# EAGLE design MagEnc (EAGLE 9.4.0)
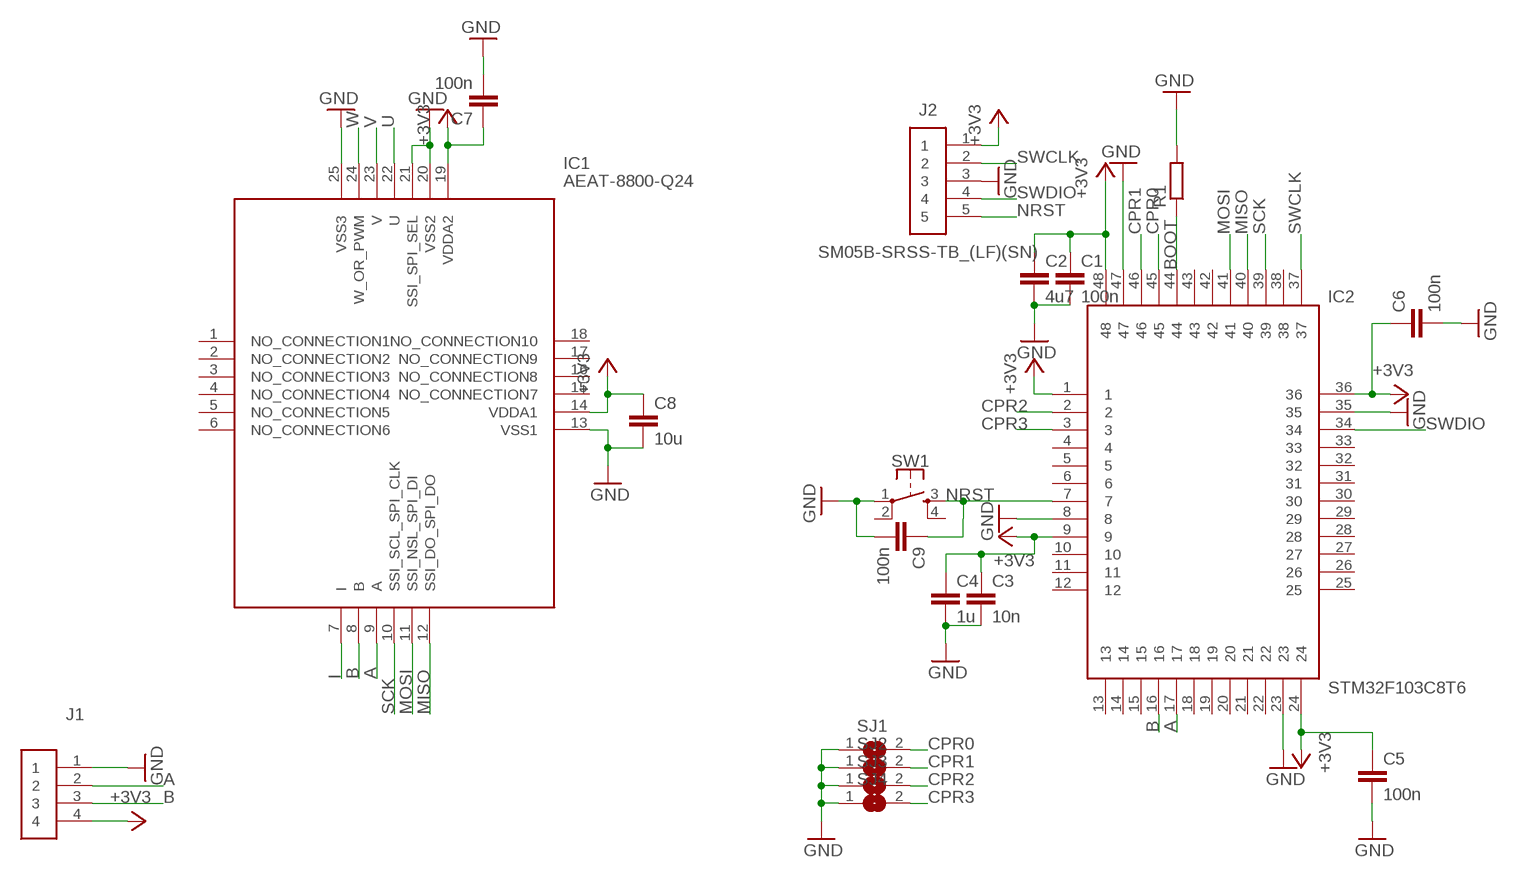
[diagram p0: schematic, sheet 1]

## Parts
C1  100n  C-EUC0402K  [C0402K]
C2  4u7  C-EUC0603K  [C0603K]
C3  10n  C-EUC0402K  [C0402K]
C4  1u  C-EUC0603K  [C0603K]
C5  100n  C-EUC0402K  [C0402K]
C6  100n  C-EUC0402K  [C0402K]
C7  100n  C-EUC0402K  [C0402K]
C8  10u  C-EUC0603K  [C0603K]
C9  100n  C-EUC0402K  [C0402K]
IC1  AEAT-8800-Q24  [QFN65P500X500X90-25N]
IC2  STM32F103C8T6  STM32_LQFP48_7X7  [QFP50P900X900X160-48N]
J1  DF65-4P-1.7V(21)  [DF654P17V21]
J2  SM05B-SRSS-TB_(LF)(SN)  [SM05B-SRSS-TB]
R1  R-EU_R0402  [R0402]
SJ1  SJ  [SJ]
SJ2  SJ  [SJ]
SJ3  SJ  [SJ]
SJ4  SJ  [SJ]
SW1  SKRPACE010  [SMT(4.2X3.2)]

## Nets
+3V3: C1.1 C2.1 C3.1 C4.1 C5.1 C6.1 C7.1 C8.1 IC1.14(VDDA1) IC1.19(VDDA2) IC2.1 IC2.9 IC2.24 IC2.36 IC2.48 J1.4 J2.1
A: IC1.9(A) IC2.17 J1.2
B: IC1.8(B) IC2.16 J1.3
BOOT: IC2.44 R1.1
CPR0: IC2.45 SJ1.2
CPR1: IC2.46 SJ2.2
CPR2: IC2.2 SJ3.2
CPR3: IC2.3 SJ4.2
GND: C1.2 C2.2 C3.2 C4.2 C5.2 C6.2 C7.2 C8.2 C9.2 IC1.13(VSS1) IC1.20(VSS2) IC1.21(SSI_SPI_SEL) IC1.25(VSS3) IC2.8 IC2.23 IC2.35 IC2.47 J1.1 J2.3 R1.2 SJ1.1 SJ2.1 SJ3.1 SJ4.1 SW1.1
I: IC1.7(I)
MISO: IC1.12(SSI_DO_SPI_DO) IC2.40
MOSI: IC1.11(SSI_NSL_SPI_DI) IC2.41
NRST: C9.1 IC2.7 J2.5 SW1.3
SCK: IC1.10(SSI_SCL_SPI_CLK) IC2.39
SWCLK: IC2.37 J2.2
SWDIO: IC2.34 J2.4
U: IC1.22(U)
V: IC1.23(V)
W: IC1.24(W_OR_PWM)
Unconnected: IC1.1(NO_CONNECTION1) IC1.2(NO_CONNECTION2) IC1.3(NO_CONNECTION3) IC1.4(NO_CONNECTION4) IC1.5(NO_CONNECTION5) IC1.6(NO_CONNECTION6) IC1.15(NO_CONNECTION7) IC1.16(NO_CONNECTION8) IC1.17(NO_CONNECTION9) IC1.18(NO_CONNECTION10) IC2.4 IC2.5 IC2.6 IC2.10 IC2.11 IC2.12 IC2.13 IC2.14 IC2.15 IC2.18 IC2.19 IC2.20 IC2.21 IC2.22 IC2.25 IC2.26 IC2.27 IC2.28 IC2.29 IC2.30 IC2.31 IC2.32 IC2.33 IC2.38 IC2.42 IC2.43 SW1.2 SW1.4

## Library data of the parts
C1-C9 = rcl:C-EU: CAPACITOR, European symbol; SPICEPREFIX: C
IC1 = AEAT-8800-Q24:AEAT-8800-Q24: 16-BIT PROG ANG ENCODER Source: Datasheet <https://jp.broadcom.com/products/motion-control-encoders/magnetic-encoders/aeat-8800-q24>; ARROW_PART_NUMBER: AEAT-8800-Q24; DESCRIPTION: 16-BIT PROG ANG ENCODER; HEIGHT: 0.9mm; MANUFACTURER_NAME: Avago Technologies; MANUFACTURER_PART_NUMBER: AEAT-8800-Q24
IC2 = STM32:STM32_LQFP48_7X7
J1 = DF65-4P-1.7V(21):DF65-4P-1.7V(21): Hirose DF Series, Series Number 65, 1.7mm Pitch 4 Way 1 Row Straight PCB Header, Solder Termination, 4A Source: Datasheet <https://www.hirose.com/product/en/download_file/key_name/DF65-4P-1.7V(21)/category/Drawing (2D)/doc_file_id/45650/?file_category_id=6&item_id=06666006021&is_series=>; DESCRIPTION: Hirose DF Series, Series Number 65, 1.7mm Pitch 4 Way 1 Row Straight PCB Header, Solder Termination, 4A; HEIGHT: 1mm; MANUFACTURER_NAME: Hirose; MANUFACTURER_PART_NUMBER: DF65-4P-1.7V(21); RS_PART_NUMBER: 8735161P; SUPPLIER_NAME: RS
J2 = SMxxB-SRSS-TB_(LF)(SN):SM05B-SRSS-TB_(LF)(SN): JST SH Series, 1mm Pitch 5 Way 1 Row Right Angle PCB Header, Solder Termination, 1A <https://componentsearchengine.com/Images/9/SM05B-SRSS-TB%28LF%29%28SN%29.jpg> Source: Datasheet <http://www.jst-mfg.com/product/pdf/eng/eSH.pdf>; DESCRIPTION: JST SH Series, 1mm Pitch 5 Way 1 Row Right Angle PCB Header, Solder Termination, 1A; HEIGHT: mm; MANUFACTURER_NAME: JST (JAPAN SOLDERLESS TERMINALS); MANUFACTURER_PART_NUMBER: SM05B-SRSS-TB(LF)(SN); SUPPLIER_NAME: RS
R1 = rcl:R-EU_: RESISTOR, European symbol; SPICEPREFIX: R
SJ1-SJ4 = jumper:SJ: SMD solder JUMPER
SW1 = SKRPACE010:SKRPACE010: Tactile Switches 4.2x3.2x2.5mm 260gf Source: Datasheet <http://www.alps.com/prod/info/E/HTML/Tact/SurfaceMount/SKRP/SKRPACE010.html>

## Board
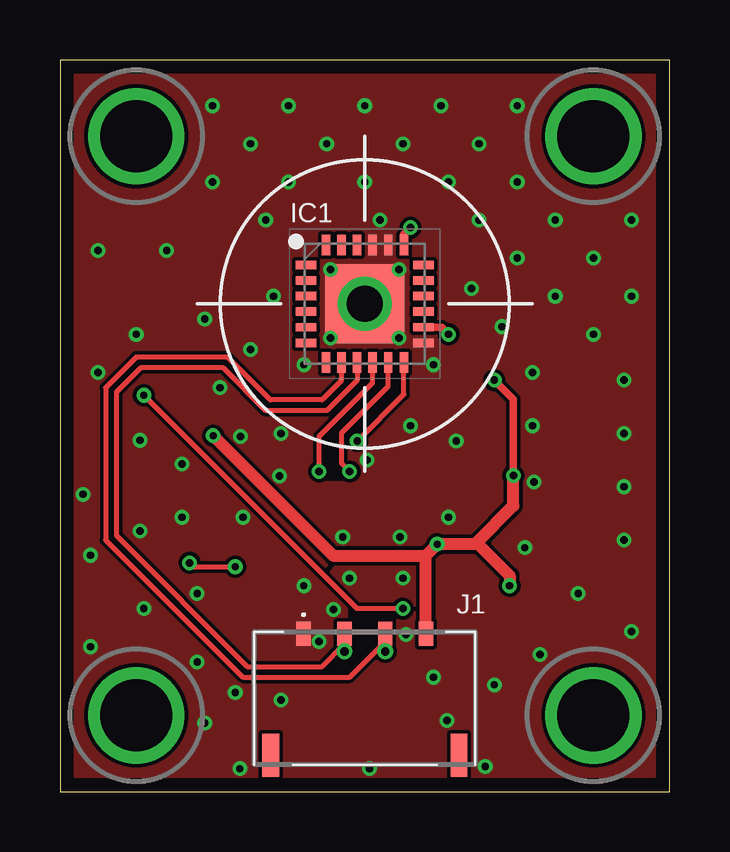
[diagram p1: board, top side]
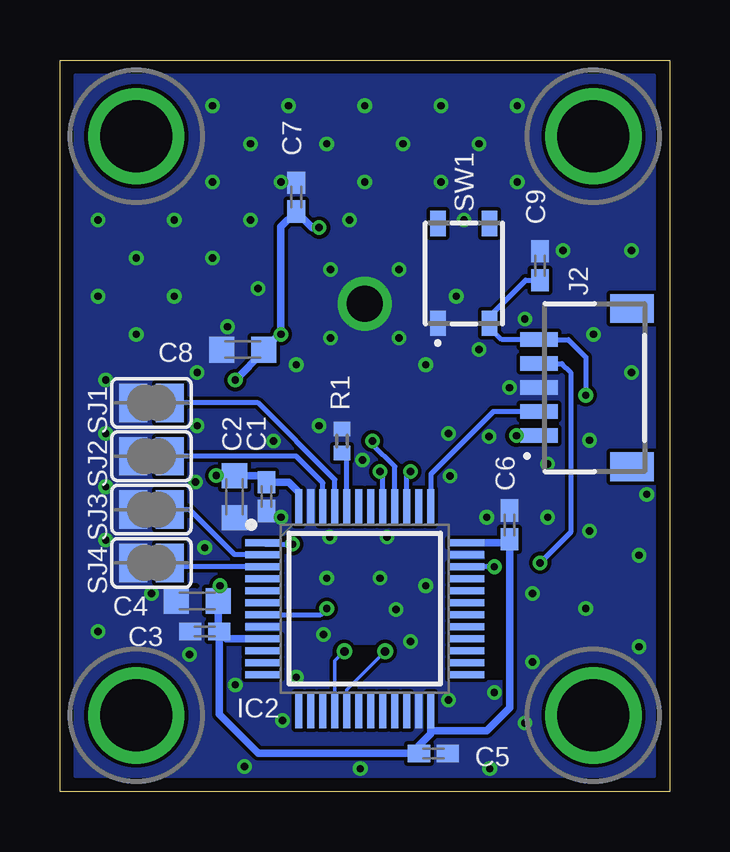
[diagram p2: board, bottom side, seen from below]

Size 25.4 x 30.48 mm. Coordinates in mm from the lower left corner, seen from the top.
Outline: 0,0 25.4,0 25.4,30.48 0,30.48 0,0
Copper layers (1*16): Top 0.035mm / dielectric 1.6mm / Bottom 0.035mm
Design rules "Elecrow_2-layer_PCB_eagle_rule": minimum track width 6mil, minimum drill 12mil, track to track 6mil, track to pad 6mil, pad to pad 6mil, via to via 8mil, smd to smd 0mil, copper to edge 20mil, drill to drill 10mil, minimum pad ring 6mil, minimum via ring 6mil, stop-mask expansion 0mil, vias tented up to drill 100mil, thermal gap 10mil
tRestrict: 3 lines
bRestrict: 5 lines

### Footprints (pad centres in the part's own frame; a part is rotated, then mirrored left to right if it is on the bottom)
C0402K = smd 0.925 x 0.74: 1 -0.6,0; 2 0.6,0
C0603K = smd 1.05 x 1.08: 1 -0.875,0; 2 0.875,0
QFN65P500X500X90-25N = smd 0.85 x 0.35: 1 -2.45,1.625; 2 -2.45,0.975; 3 -2.45,0.325; 4 -2.45,-0.325; 5 -2.45,-0.975; 6 -2.45,-1.625; 13 2.45,-1.625; 14 2.45,-0.975; 15 2.45,-0.325; 16 2.45,0.325; 17 2.45,0.975; 18 2.45,1.625 | smd 0.35 x 0.85: 7 -1.625,-2.45; 8 -0.975,-2.45; 9 -0.325,-2.45; 10 0.325,-2.45; 11 0.975,-2.45; 12 1.625,-2.45; 19 1.625,2.45; 20 0.975,2.45; 21 0.325,2.45; 22 -0.325,2.45; 23 -0.975,2.45; 24 -1.625,2.45 | smd 3.3 x 3.3: 25 0,0
QFP50P900X900X160-48N = smd 1.475 x 0.3: 1 -4.238,2.75; 2 -4.238,2.25; 3 -4.238,1.75; 4 -4.238,1.25; 5 -4.238,0.75; 6 -4.238,0.25; 7 -4.238,-0.25; 8 -4.238,-0.75; 9 -4.238,-1.25; 10 -4.238,-1.75; 11 -4.238,-2.25; 12 -4.238,-2.75; 25 4.238,-2.75; 26 4.238,-2.25; 27 4.238,-1.75; 28 4.238,-1.25; 29 4.238,-0.75; 30 4.238,-0.25; 31 4.238,0.25; 32 4.238,0.75; 33 4.238,1.25; 34 4.238,1.75; 35 4.238,2.25; 36 4.238,2.75 | smd 0.3 x 1.475: 13 -2.75,-4.238; 14 -2.25,-4.238; 15 -1.75,-4.238; 16 -1.25,-4.238; 17 -0.75,-4.238; 18 -0.25,-4.238; 19 0.25,-4.238; 20 0.75,-4.238; 21 1.25,-4.238; 22 1.75,-4.238; 23 2.25,-4.238; 24 2.75,-4.238; 37 2.75,4.238; 38 2.25,4.238; 39 1.75,4.238; 40 1.25,4.238; 41 0.75,4.238; 42 0.25,4.238; 43 -0.25,4.238; 44 -0.75,4.238; 45 -1.25,4.238; 46 -1.75,4.238; 47 -2.25,4.238; 48 -2.75,4.238
DF654P17V21 = smd 0.6 x 1: 1 -2.55,-0.1; 2 -0.85,-0.1; 3 0.85,-0.1; 4 2.55,-0.1 | smd 0.7 x 1.8: 5 -3.925,-5.15; 6 3.925,-5.15
SM05B-SRSS-TB = smd 0.6 x 1.55: 1 -2,1; 2 -1,1; 3 0,1; 4 1,1; 5 2,1 | smd 1.2 x 1.8: 6 3.3,-2.875; 7 -3.3,-2.875
R0402 = smd 0.6 x 0.7: 1 -0.5,0; 2 0.5,0
SJ = smd 1.168 x 1.6: 1 -0.762,0; 2 0.762,0
SMT(4.2X3.2) = smd 1.05 x 0.65: 1 -2.075,1.075; 2 2.075,1.075; 3 -2.075,-1.075; 4 2.075,-1.075

### Placement (x,y rotation side)
C1  16.8,12.29 270 bottom
C2  18.13,12.29 270 bottom
C3  19.37,6.67 180 bottom
C4  19.68,7.94 180 bottom
C5  9.84,1.59 0 bottom
C6  6.67,11.11 90 bottom
C7  15.56,24.77 90 bottom
C8  17.78,18.41 180 bottom
C9  5.4,21.91 90 bottom
IC1  12.7,20.32 0 top
IC2  12.7,7.62 0 bottom
J1  12.7,6.67 0 top
J2  4.45,16.83 90 bottom
R1  13.65,14.61 90 bottom
SJ1  21.59,16.19 0 bottom
SJ2  21.59,13.97 0 bottom
SJ3  21.59,11.75 0 bottom
SJ4  21.59,9.53 0 bottom
SW1  8.57,21.59 90 bottom

### Tracks (layer width: path | path; a pad name or v marks a point on that pad's centre or on a via)
+3V3  (via drill 0.3)
  Top 0.254: J1.4
  Top 0.305: v18.89,13.16 18.89,16.35 v18.1,17.14 | v16.19,19.05 15.9,19.34 IC1.14 | v14.61,23.5 14.32,23.21 IC1.19
  Top 0.508: 17.42,10.31 v15.72,10.31 15.24,9.83 | v18.89,13.16 18.89,11.91 17.36,10.37 17.42,10.31 | J1.4 15.24,9.83 | 17.42,10.31 18.73,8.99 v18.73,8.57 | v6.38,14.83 11.38,9.83 15.24,9.83
  Bottom 0.203: IC2.48 15.45,12.47 | C1.1 17.07,13.16 | C2.1 v18.89,13.16 | IC2.1 16.88,10.31 v15.72,10.31 | 18.81,6.71 C3.1 18.47,6.37 | 6.81,10.37 6.68,10.49 | 6.68,10.49 C6.1 | C5.1 10.44,1.91 | 9.95,2.4 9.95,2.54 | 6.67,10.48 6.68,10.49
  Bottom 0.254: v18.73,8.57 18.81,8.49 C4.1 | v6.38,14.83
  Bottom 0.305: 15.45,12.47 15.87,12.89 C1.1 | 17.07,13.16 C2.1 | C4.1 18.81,6.71 | 18.47,6.37 IC2.9 | IC2.36 6.81,10.37 | C3.1 18.77,3.21 17.14,1.59 C5.1 | 10.44,1.91 9.95,2.4 | IC2.24 9.95,2.54 7.62,2.54 6.67,3.49 6.67,10.48 | v18.1,17.14 16.91,18.34 C8.1 16.27,19.05 v16.19,19.05 16.19,23.53 C7.1 14.89,23.5 v14.61,23.5
  Bottom 0.508: J2.1 v6.38,14.83
A  (via drill 0.35)
  Top 0.152: J1.2 v11.85,5.84
  Top 0.203: IC1.9 12.38,17.14 11.11,15.88 8.57,15.88 6.79,17.65 3.37,17.65 2.35,16.64 2.35,10.67 7.81,5.21 10.92,5.21 11.85,6.13 J1.2
  Bottom 0.152: v11.85,5.84 13.45,4.24 IC2.17
B  (via drill 0.35)
  Top 0.152: J1.3 v13.55,5.84
  Top 0.203: IC1.8 11.72,17.12 10.92,16.32 8.76,16.32 6.99,18.1 3.17,18.1 1.91,16.83 1.91,10.48 7.62,4.76 12.06,4.76 13.55,6.25 J1.3
  Bottom 0.152: v13.55,5.84 13.95,5.44 IC2.16
BOOT
  Bottom 0.203: IC2.44 13.45,13.9 R1.1
CPR0
  Bottom 0.203: SJ1.2 17.14,16.19 13.95,13 IC2.45
CPR1
  Bottom 0.203: SJ2.2 15.56,13.97 14.45,12.86 IC2.46
CPR2
  Bottom 0.203: IC2.2 18.12,9.87 20,11.75 SJ3.2
CPR3
  Bottom 0.203: SJ4.2 20.67,9.37 IC2.3
GND  (via drill 0.3, 1.5)
  other vias: 12.7,20.32 19.37,10.16 23.5,10.48 12.06,8.89 10.16,8.57 10.79,6.25 14.29,8.89 14.41,6.54 11.4,7.59 7.3,4.13 9.21,3.81 5.71,5.4 6.03,2.86 16.13,2.95 17.72,1.05 12.89,0.95 7.49,0.95 3.49,7.62 1.27,9.84 0.95,12.38 1.59,17.46 3.17,19.05 1.59,22.54 4.45,22.54 8.89,20.64 7.94,18.41 6.03,19.68 6.67,16.83 9.21,14.92 7.52,14.8 9.14,13.14 5.08,13.65 5.08,11.43 7.62,11.43 5.71,8.26 3.33,10.86 3.33,14.64 15.56,4.76 18.1,4.45 20,5.71 21.59,8.26 23.81,6.67 23.5,12.7 23.5,14.92 23.5,17.14 16.51,14.61 19.68,15.24 19.75,12.89 19.68,17.46 15.56,17.78 14.61,15.24 12.8,13.81 10.16,17.78 8.57,23.81 13.34,23.81 17.14,20.95 16.19,25.4 12.7,28.57 9.53,28.57 6.35,28.57 7.94,26.99 11.11,26.99 9.53,25.4 6.35,25.4 12.7,25.4 14.29,26.99 15.88,28.57 17.46,26.99 19.05,28.57 19.05,25.4 17.46,23.81 19.05,22.23 20.64,23.81 22.23,22.23 23.81,23.81 23.81,20.64 20.64,20.64 22.23,19.05 16.19,11.43 14.16,10.6 11.78,10.6 1.27,6.03 18.41,19.37 14.13,21.75 11.27,21.75 11.27,18.89 14.13,18.89
  pour Top (no thermals): 0.64,29.84 24.77,29.84 24.77,0.64 0.64,0.64
  pour Bottom (no thermals): 0.64,29.84 24.77,29.84 24.77,0.64 0.64,0.64
MISO  (via drill 0.3)
  Top 0.203: v12.38,14.61 14.32,16.55 IC1.12
  Bottom 0.203: IC2.40 11.45,13.55 12.38,14.48 v12.38,14.61
MOSI  (via drill 0.3)
  Top 0.203: v12.06,13.34 11.75,13.65 11.75,14.95 13.68,16.88 IC1.11
  Bottom 0.203: IC2.41 11.95,13.22 v12.06,13.34
N$1  (via drill 3)
  other vias: 3.17,27.3
N$2  (via drill 3)
  other vias: 22.23,27.3
N$3  (via drill 3)
  other vias: 22.23,3.17
N$4  (via drill 3)
  other vias: 3.17,3.17
NRST  (via drill 0.3)
  Top 0.203: v14.29,7.62 12.38,7.62 v3.49,16.51
  Bottom 0.203: IC2.7 14.54,7.37 v14.29,7.62 | v3.49,16.51 3.49,18.1 4.22,18.83 J2.5 6.99,18.83 7.5,19.34 SW1.3 7.5,19.81 6,21.31 C9.1
SCK  (via drill 0.3)
  Top 0.203: v10.79,13.34 10.79,14.8 13.03,17.03 IC1.10
  Bottom 0.203: IC2.39 10.95,13.18 v10.79,13.34
SWCLK
  Bottom 0.203: J2.2 7.35,15.83 9.95,13.23 IC2.37
SWDIO  (via drill 0.3)
  Top 0.203: v5.4,9.53 5.56,9.37 v7.3,9.37
  Bottom 0.203: J2.4 4.49,17.83 4.13,17.46 4.13,10.79 v5.4,9.53 | v7.3,9.37 v7.31,9.37 IC2.34